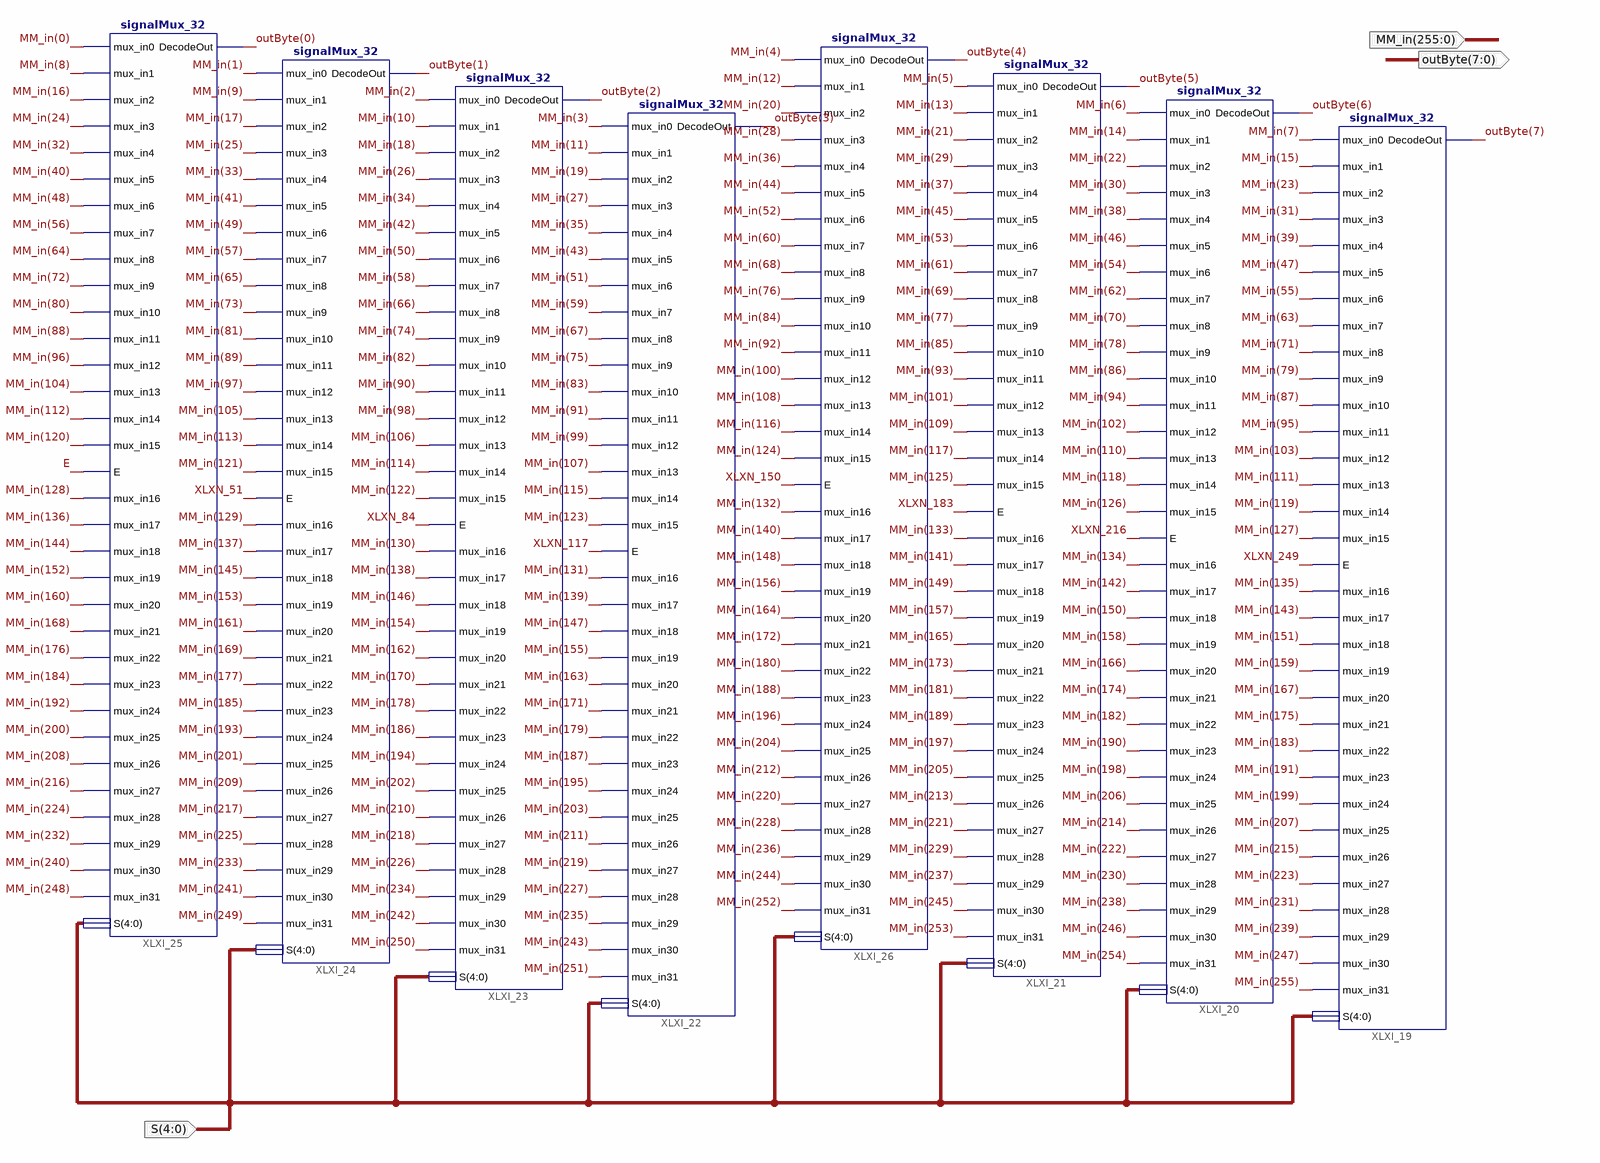
[diagram p0: schematic sheet 1]
// Xilinx ISE schematic MM_signal_MUX.sch (spartan3e) as structural Verilog: 8 symbols, 3 ports
module MM_signal_MUX (
  input  [255:0] MM_in,
  input  [4:0] S,
  output [7:0] outByte
);

  wire E, XLXN_51, XLXN_84, XLXN_117, XLXN_150, XLXN_183, XLXN_216, XLXN_249;

  signalMux_32 XLXI_24 (
    .mux_in0(MM_in[1]), .mux_in1(MM_in[9]), .mux_in2(MM_in[17]), .mux_in3(MM_in[25]), .mux_in4(MM_in[33]),
    .mux_in5(MM_in[41]), .mux_in6(MM_in[49]), .mux_in7(MM_in[57]), .mux_in8(MM_in[65]), .mux_in9(MM_in[73]),
    .mux_in10(MM_in[81]), .mux_in11(MM_in[89]), .mux_in12(MM_in[97]), .mux_in13(MM_in[105]),
    .mux_in14(MM_in[113]), .mux_in15(MM_in[121]), .E(XLXN_51), .mux_in16(MM_in[129]), .mux_in17(MM_in[137]),
    .mux_in18(MM_in[145]), .mux_in19(MM_in[153]), .mux_in20(MM_in[161]), .mux_in21(MM_in[169]),
    .mux_in22(MM_in[177]), .mux_in23(MM_in[185]), .mux_in24(MM_in[193]), .mux_in25(MM_in[201]),
    .mux_in26(MM_in[209]), .mux_in27(MM_in[217]), .mux_in28(MM_in[225]), .mux_in29(MM_in[233]),
    .mux_in30(MM_in[241]), .mux_in31(MM_in[249]), .S(S), .DecodeOut(outByte[1]));
  signalMux_32 XLXI_23 (
    .mux_in0(MM_in[2]), .mux_in1(MM_in[10]), .mux_in2(MM_in[18]), .mux_in3(MM_in[26]), .mux_in4(MM_in[34]),
    .mux_in5(MM_in[42]), .mux_in6(MM_in[50]), .mux_in7(MM_in[58]), .mux_in8(MM_in[66]), .mux_in9(MM_in[74]),
    .mux_in10(MM_in[82]), .mux_in11(MM_in[90]), .mux_in12(MM_in[98]), .mux_in13(MM_in[106]),
    .mux_in14(MM_in[114]), .mux_in15(MM_in[122]), .E(XLXN_84), .mux_in16(MM_in[130]), .mux_in17(MM_in[138]),
    .mux_in18(MM_in[146]), .mux_in19(MM_in[154]), .mux_in20(MM_in[162]), .mux_in21(MM_in[170]),
    .mux_in22(MM_in[178]), .mux_in23(MM_in[186]), .mux_in24(MM_in[194]), .mux_in25(MM_in[202]),
    .mux_in26(MM_in[210]), .mux_in27(MM_in[218]), .mux_in28(MM_in[226]), .mux_in29(MM_in[234]),
    .mux_in30(MM_in[242]), .mux_in31(MM_in[250]), .S(S), .DecodeOut(outByte[2]));
  signalMux_32 XLXI_22 (
    .mux_in0(MM_in[3]), .mux_in1(MM_in[11]), .mux_in2(MM_in[19]), .mux_in3(MM_in[27]), .mux_in4(MM_in[35]),
    .mux_in5(MM_in[43]), .mux_in6(MM_in[51]), .mux_in7(MM_in[59]), .mux_in8(MM_in[67]), .mux_in9(MM_in[75]),
    .mux_in10(MM_in[83]), .mux_in11(MM_in[91]), .mux_in12(MM_in[99]), .mux_in13(MM_in[107]),
    .mux_in14(MM_in[115]), .mux_in15(MM_in[123]), .E(XLXN_117), .mux_in16(MM_in[131]), .mux_in17(MM_in[139]),
    .mux_in18(MM_in[147]), .mux_in19(MM_in[155]), .mux_in20(MM_in[163]), .mux_in21(MM_in[171]),
    .mux_in22(MM_in[179]), .mux_in23(MM_in[187]), .mux_in24(MM_in[195]), .mux_in25(MM_in[203]),
    .mux_in26(MM_in[211]), .mux_in27(MM_in[219]), .mux_in28(MM_in[227]), .mux_in29(MM_in[235]),
    .mux_in30(MM_in[243]), .mux_in31(MM_in[251]), .S(S), .DecodeOut(outByte[3]));
  signalMux_32 XLXI_26 (
    .mux_in0(MM_in[4]), .mux_in1(MM_in[12]), .mux_in2(MM_in[20]), .mux_in3(MM_in[28]), .mux_in4(MM_in[36]),
    .mux_in5(MM_in[44]), .mux_in6(MM_in[52]), .mux_in7(MM_in[60]), .mux_in8(MM_in[68]), .mux_in9(MM_in[76]),
    .mux_in10(MM_in[84]), .mux_in11(MM_in[92]), .mux_in12(MM_in[100]), .mux_in13(MM_in[108]),
    .mux_in14(MM_in[116]), .mux_in15(MM_in[124]), .E(XLXN_150), .mux_in16(MM_in[132]), .mux_in17(MM_in[140]),
    .mux_in18(MM_in[148]), .mux_in19(MM_in[156]), .mux_in20(MM_in[164]), .mux_in21(MM_in[172]),
    .mux_in22(MM_in[180]), .mux_in23(MM_in[188]), .mux_in24(MM_in[196]), .mux_in25(MM_in[204]),
    .mux_in26(MM_in[212]), .mux_in27(MM_in[220]), .mux_in28(MM_in[228]), .mux_in29(MM_in[236]),
    .mux_in30(MM_in[244]), .mux_in31(MM_in[252]), .S(S), .DecodeOut(outByte[4]));
  signalMux_32 XLXI_21 (
    .mux_in0(MM_in[5]), .mux_in1(MM_in[13]), .mux_in2(MM_in[21]), .mux_in3(MM_in[29]), .mux_in4(MM_in[37]),
    .mux_in5(MM_in[45]), .mux_in6(MM_in[53]), .mux_in7(MM_in[61]), .mux_in8(MM_in[69]), .mux_in9(MM_in[77]),
    .mux_in10(MM_in[85]), .mux_in11(MM_in[93]), .mux_in12(MM_in[101]), .mux_in13(MM_in[109]),
    .mux_in14(MM_in[117]), .mux_in15(MM_in[125]), .E(XLXN_183), .mux_in16(MM_in[133]), .mux_in17(MM_in[141]),
    .mux_in18(MM_in[149]), .mux_in19(MM_in[157]), .mux_in20(MM_in[165]), .mux_in21(MM_in[173]),
    .mux_in22(MM_in[181]), .mux_in23(MM_in[189]), .mux_in24(MM_in[197]), .mux_in25(MM_in[205]),
    .mux_in26(MM_in[213]), .mux_in27(MM_in[221]), .mux_in28(MM_in[229]), .mux_in29(MM_in[237]),
    .mux_in30(MM_in[245]), .mux_in31(MM_in[253]), .S(S), .DecodeOut(outByte[5]));
  signalMux_32 XLXI_20 (
    .mux_in0(MM_in[6]), .mux_in1(MM_in[14]), .mux_in2(MM_in[22]), .mux_in3(MM_in[30]), .mux_in4(MM_in[38]),
    .mux_in5(MM_in[46]), .mux_in6(MM_in[54]), .mux_in7(MM_in[62]), .mux_in8(MM_in[70]), .mux_in9(MM_in[78]),
    .mux_in10(MM_in[86]), .mux_in11(MM_in[94]), .mux_in12(MM_in[102]), .mux_in13(MM_in[110]),
    .mux_in14(MM_in[118]), .mux_in15(MM_in[126]), .E(XLXN_216), .mux_in16(MM_in[134]), .mux_in17(MM_in[142]),
    .mux_in18(MM_in[150]), .mux_in19(MM_in[158]), .mux_in20(MM_in[166]), .mux_in21(MM_in[174]),
    .mux_in22(MM_in[182]), .mux_in23(MM_in[190]), .mux_in24(MM_in[198]), .mux_in25(MM_in[206]),
    .mux_in26(MM_in[214]), .mux_in27(MM_in[222]), .mux_in28(MM_in[230]), .mux_in29(MM_in[238]),
    .mux_in30(MM_in[246]), .mux_in31(MM_in[254]), .S(S), .DecodeOut(outByte[6]));
  signalMux_32 XLXI_19 (
    .mux_in0(MM_in[7]), .mux_in1(MM_in[15]), .mux_in2(MM_in[23]), .mux_in3(MM_in[31]), .mux_in4(MM_in[39]),
    .mux_in5(MM_in[47]), .mux_in6(MM_in[55]), .mux_in7(MM_in[63]), .mux_in8(MM_in[71]), .mux_in9(MM_in[79]),
    .mux_in10(MM_in[87]), .mux_in11(MM_in[95]), .mux_in12(MM_in[103]), .mux_in13(MM_in[111]),
    .mux_in14(MM_in[119]), .mux_in15(MM_in[127]), .E(XLXN_249), .mux_in16(MM_in[135]), .mux_in17(MM_in[143]),
    .mux_in18(MM_in[151]), .mux_in19(MM_in[159]), .mux_in20(MM_in[167]), .mux_in21(MM_in[175]),
    .mux_in22(MM_in[183]), .mux_in23(MM_in[191]), .mux_in24(MM_in[199]), .mux_in25(MM_in[207]),
    .mux_in26(MM_in[215]), .mux_in27(MM_in[223]), .mux_in28(MM_in[231]), .mux_in29(MM_in[239]),
    .mux_in30(MM_in[247]), .mux_in31(MM_in[255]), .S(S), .DecodeOut(outByte[7]));
  signalMux_32 XLXI_25 (
    .mux_in0(MM_in[0]), .mux_in1(MM_in[8]), .mux_in2(MM_in[16]), .mux_in3(MM_in[24]), .mux_in4(MM_in[32]),
    .mux_in5(MM_in[40]), .mux_in6(MM_in[48]), .mux_in7(MM_in[56]), .mux_in8(MM_in[64]), .mux_in9(MM_in[72]),
    .mux_in10(MM_in[80]), .mux_in11(MM_in[88]), .mux_in12(MM_in[96]), .mux_in13(MM_in[104]),
    .mux_in14(MM_in[112]), .mux_in15(MM_in[120]), .E(E), .mux_in16(MM_in[128]), .mux_in17(MM_in[136]),
    .mux_in18(MM_in[144]), .mux_in19(MM_in[152]), .mux_in20(MM_in[160]), .mux_in21(MM_in[168]),
    .mux_in22(MM_in[176]), .mux_in23(MM_in[184]), .mux_in24(MM_in[192]), .mux_in25(MM_in[200]),
    .mux_in26(MM_in[208]), .mux_in27(MM_in[216]), .mux_in28(MM_in[224]), .mux_in29(MM_in[232]),
    .mux_in30(MM_in[240]), .mux_in31(MM_in[248]), .S(S), .DecodeOut(outByte[0]));
endmodule
